# EAGLE design AntCalc (EAGLE 9.2.0)
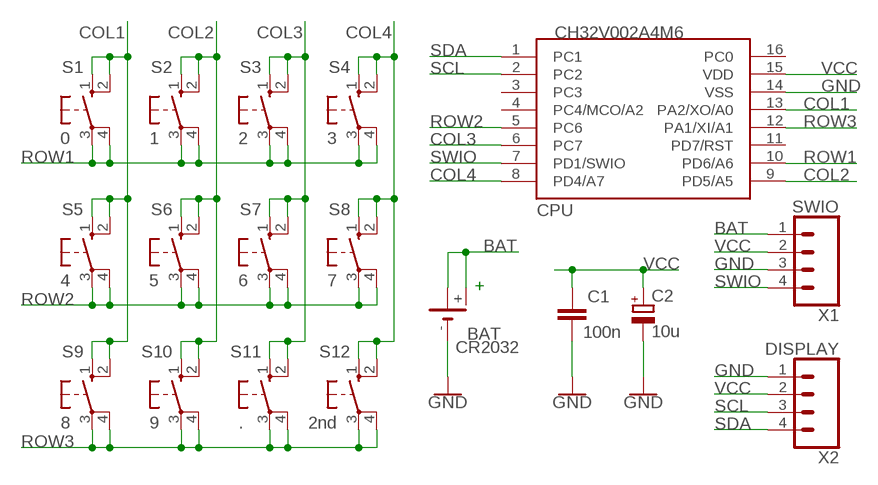
[diagram p0: schematic, sheet 1]

## Parts
BAT  CR2032  CR2032H  [CR2032H]
C1  100n  C-EUC0805K  [C0805K]
C2  10u  CPOL-EUB  [PANASONIC_B]
CPU  CH32V002A4M6  [SOP16]
S1  0  10-XXB3F-10XXC  [B3F-10XXC]
S2  1  10-XXB3F-10XXC  [B3F-10XXC]
S3  2  10-XXB3F-10XXC  [B3F-10XXC]
S4  3  10-XXB3F-10XXC  [B3F-10XXC]
S5  4  10-XXB3F-10XXC  [B3F-10XXC]
S6  5  10-XXB3F-10XXC  [B3F-10XXC]
S7  6  10-XXB3F-10XXC  [B3F-10XXC]
S8  7  10-XXB3F-10XXC  [B3F-10XXC]
S9  8  10-XXB3F-10XXC  [B3F-10XXC]
S10  9  10-XXB3F-10XXC  [B3F-10XXC]
S11  .  10-XXB3F-10XXC  [B3F-10XXC]
S12  2nd  10-XXB3F-10XXC  [B3F-10XXC]
X1  SWIO  CONN_04LONGPADS  [1X04_LONGPADS]
X2  DISPLAY  CONN_04  [1X04]

## Nets
BAT: BAT.+ BAT.+@1(+) X1.1
COL1: CPU.13(PA2/XO/A0) S1.1(S) S1.2(S1) S5.1(S) S5.2(S1) S9.1(S) S9.2(S1)
COL2: CPU.9(PD5/A5) S2.1(S) S2.2(S1) S6.1(S) S6.2(S1) S10.1(S) S10.2(S1)
COL3: CPU.6(PC7) S3.1(S) S3.2(S1) S7.1(S) S7.2(S1) S11.1(S) S11.2(S1)
COL4: CPU.8(PD4/A7) S4.1(S) S4.2(S1) S8.1(S) S8.2(S1) S12.1(S) S12.2(S1)
GND: BAT.- C1.2 C2.- CPU.14(VSS) X1.3 X2.1
ROW1: CPU.10(PD6/A6) S1.3(P) S1.4(P1) S2.3(P) S2.4(P1) S3.3(P) S3.4(P1) S4.3(P) S4.4(P1)
ROW2: CPU.5(PC6) S5.3(P) S5.4(P1) S6.3(P) S6.4(P1) S7.3(P) S7.4(P1) S8.3(P) S8.4(P1)
ROW3: CPU.12(PA1/XI/A1) S9.3(P) S9.4(P1) S10.3(P) S10.4(P1) S11.3(P) S11.4(P1) S12.3(P) S12.4(P1)
SCL: CPU.2(PC2) X2.3
SDA: CPU.1(PC1) X2.4
SWIO: CPU.7(PD1/SWIO) X1.4
VCC: C1.1 C2.+ CPU.15(VDD) X1.2 X2.2
Unconnected: CPU.3(PC3) CPU.4(PC4/MCO/A2) CPU.11(PD7/RST) CPU.16(PC0)

## Notes on the sheet
- +

## Library data of the parts
BAT = battery:CR2032H: LI BATTERY Varta
C1 = rcl:C-EU: CAPACITOR, European symbol; SPICEPREFIX: C
C2 = rcl:CPOL-EU: POLARIZED CAPACITOR, European symbol; SPICEPREFIX: C
CPU = CH32V:CH32V002A4M6
S1-S12 = switch-omron2:10-XX: OMRON SWITCH
X1 X2 = SparkFun-Connectors:CONN_04: Multi connection point. Often used as Generic Header-pin footprint for 0.1 inch spaced/style header connections On any of the 0.1 inch spaced packages, you can populate with these: Break Away Headers - Straight <https://www.sparkfun.com/products/116> (PRT-00116) Break Away Male Headers - Right Angle <https://www.sparkfun.com/products/553> (PRT-00553) Female Headers <https://www.sparkfun.com/products/115> (PRT-00115) Break Away Headers - Machine Pin <https://www.sparkfun.com/products/117> (PRT-00117) Break Away Female Headers - Swiss Machine Pin <https://www.sparkfun.com/products/743> (PRT-00743) For SCREWTERMINALS and SPRING TERMINALS visit here: Screw Terimnals on SparkFun.com <https://www.sparkfun.com/search/results?term=Screw+Terminals> (5mm/3.5mm/2.54mm spacing) This device is also useful as a general connection point to wire up your design to another part of your project. Our various solder wires solder well into these plated through hole pads. Hook-Up Wire - Assortment (Stranded, 22 AWG) <https://www.sparkfun.com/products/11375> (PRT-11375) Hook-Up Wire - Assortment (Solid Core, 22 AWG) <https://www.sparkfun.com/products/11367> (PRT-11367) View the entire wire category on our website here <https://www.sparkfun.com/categories/141> Special notes: Molex polarized connector foot print use with SKU : PRT-08231 with associated crimp pins and housings. 1MM SMD Version SKU: PRT-10208; PROD_ID: CONN-09696

## Board
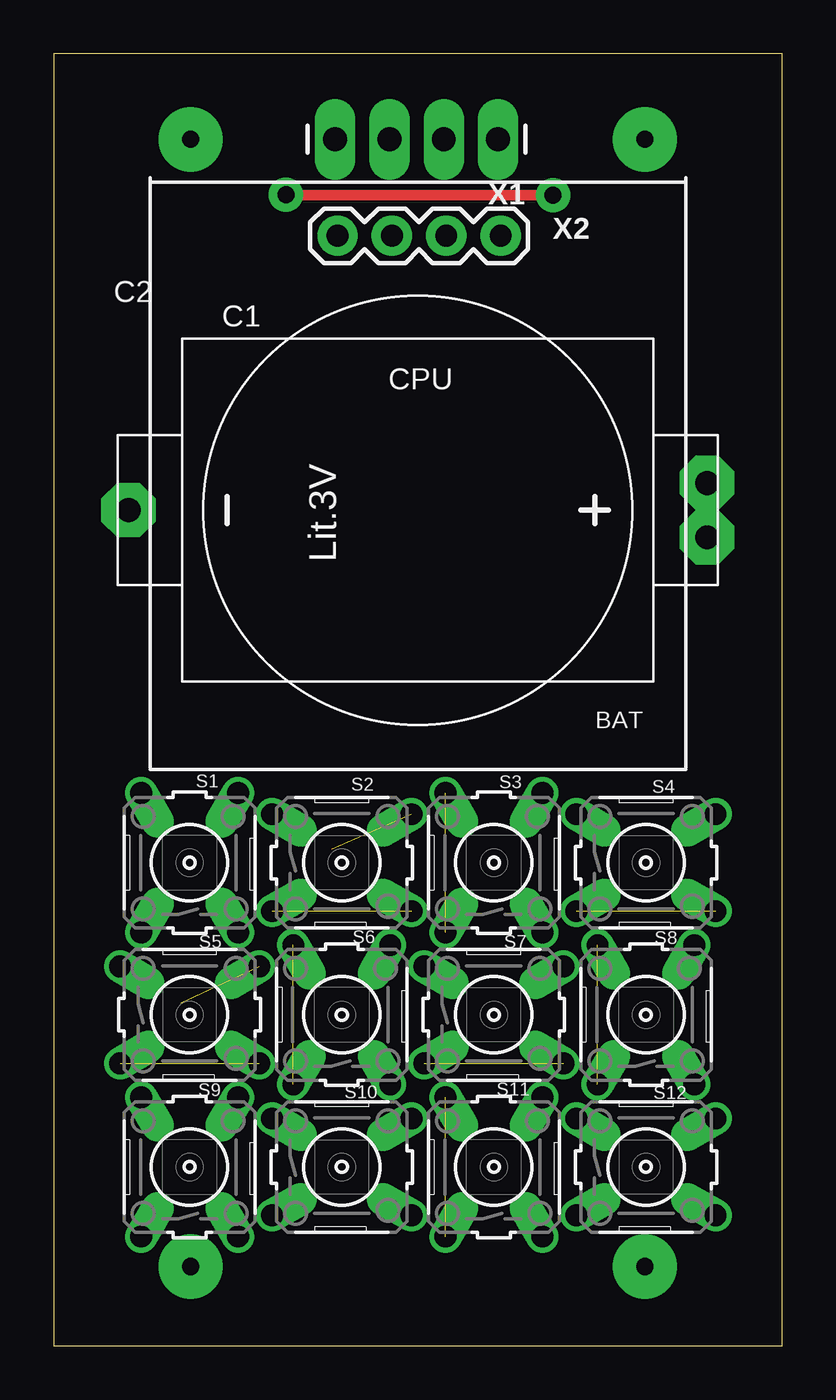
[diagram p1: board, top side]
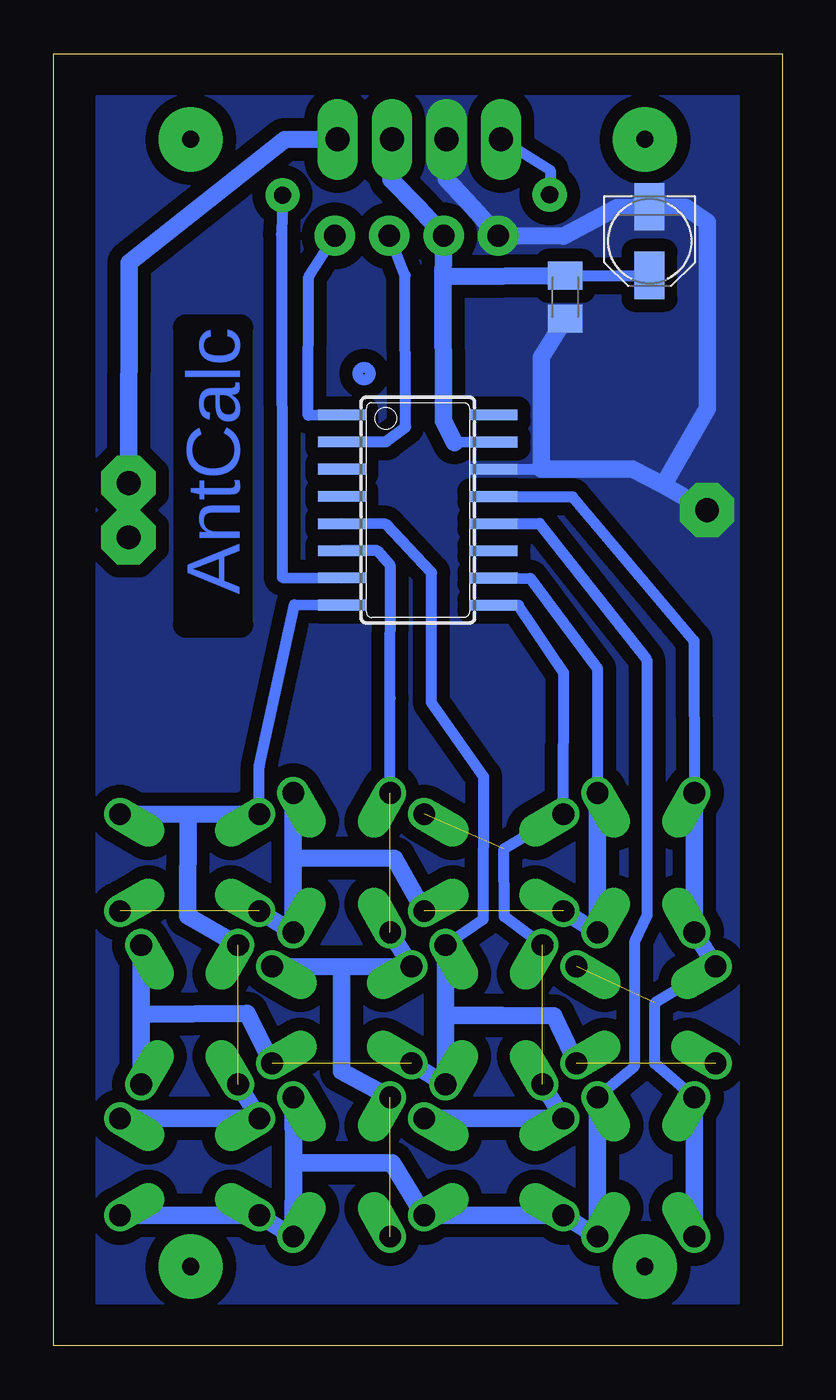
[diagram p2: board, bottom side, seen from below]

Size 34 x 60.3 mm. Coordinates in mm from the lower left corner, seen from the top.
Outline: 0,0 34,0 34,60.3 0,60.3 0,0
Copper layers (1*16): Top 0.035mm / dielectric 1.5mm / Bottom 0.035mm
Design rules "default": minimum track width 6mil, minimum drill 0.35mm, track to track 6mil, track to pad 6mil, pad to pad 6mil, via to via 6mil, smd to smd 6mil, copper to edge 40mil, drill to drill 6mil, minimum pad ring 10mil, minimum via ring 8mil, stop-mask expansion 4mil, vias tented up to drill 0mil, thermal gap 10mil

### Footprints (pad centres in the part's own frame; a part is rotated, then mirrored left to right if it is on the bottom)
CR2032H = drill 1.118 pad 2.54 octagon: + 1.27,13.5; +@1 -1.27,13.5; - 0,-13.5
C0805K = smd 1.3 x 1.6: 1 -1,0; 2 1,0
PANASONIC_B = smd 2.2 x 1.4: + 1.6,0; - -1.6,0
SOP16 = smd 0.5 x 2.2: 1 -4.445,-3.55; 2 -3.185,-3.55; 3 -1.915,-3.55; 4 -0.645,-3.55; 5 0.635,-3.55; 6 1.895,-3.55; 7 3.165,-3.55; 8 4.435,-3.55; 9 4.445,3.55; 10 3.175,3.55; 11 1.905,3.55; 12 0.635,3.55; 13 -0.635,3.55; 14 -1.905,3.55; 15 -3.175,3.55; 16 -4.445,3.55
B3F-10XXC = drill 1.016 offset: 1 -3.251,2.261; 2 3.251,2.261; 3 -3.251,-2.261; 4 3.251,-2.261
1X04_LONGPADS = drill 1.118 pad 1.88 long: 1 0,0; 2 2.54,0; 3 5.08,0; 4 7.62,0
1X04 = drill 1.016 pad 1.88: 1 0,0; 2 2.54,0; 3 5.08,0; 4 7.62,0

### Placement (x,y rotation side)
BAT  17,39 270 top
C1  10.12,48.93 270 bottom
C2  6.18,51.55 270 bottom
CPU  17,39 270 bottom
S1  6.35,22.55 90 top
S2  13.45,22.55 0 top
S3  20.55,22.55 90 top
S4  27.65,22.55 0 top
S5  6.35,15.45 0 top
S6  13.45,15.45 90 top
S7  20.55,15.45 0 top
S8  27.65,15.45 90 top
S9  6.35,8.35 90 top
S10  13.45,8.35 0 top
S11  20.55,8.35 90 top
S12  27.65,8.35 0 top
X1  20.75,56.3 180 top
X2  13.25,51.8 0 top

### Tracks (layer width: path | path; a pad name or v marks a point on that pad's centre or on a via)
BAT
  Bottom 0.813: X1.1 23.23,56.28 30.48,50.55 BAT.+@1 BAT.+
COL1  (1 unrouted)
  Bottom 0.508: S1.2 4.12,32.91 9.78,39.63 CPU.13 | S9.2 5.94,13.18 5.93,16 S5.1
  Bottom 0.813: S1.2 S1.1 S5.1 | S9.1 S9.2
COL2  (2 unrouted)
  Bottom 0.508: S6.2 12.97,20.04 12.98,23.19 S2.1 10.19,31.4 12.3,34.56 CPU.9
  Bottom 0.813: S6.1 S10.1 S10.2
COL3  (2 unrouted)
  Bottom 0.508: S3.2 18.29,30.21 18.27,36.41 18.89,37.1 CPU.6
  Bottom 0.813: S3.1 S7.1 20.56,17.7 | S11.2 20.55,12.82 20.56,17.7 | 20.56,17.7 S7.2
COL4  (1 unrouted)
  Bottom 0.508: S4.1 24.4,27.02 22.75,34.58 CPU.8 | 24.41,10.63 S12.1
  Bottom 0.813: S8.1 24.41,10.63 S12.2 | S8.2 27.74,20.07 27.73,24.8 | 27.73,24.8 S4.1 | S4.2 27.73,24.8
GND
  Bottom 0.508: CPU.14 11.23,40.92
  Bottom 0.813: X1.3 15.66,54.43 14.45,53.13 X2.1 10.2,51.78 7.71,53.12 C2.- 4.5,53.15 3.48,52.44 3.49,43.73 5.55,40.18 | 5.55,40.18 6.98,40.92 11.23,40.92 11.23,46.13 C1.2 | 5.55,40.18 BAT.-
  pour Bottom (isolate 0.61, no thermals): 2,2 2,58.3 32,58.3 32,2
N$1  (via drill 0.8 pad 3)
  other vias: 6.4,56.3
N$2  (via drill 0.8 pad 3)
  other vias: 27.6,56.3
N$3  (via drill 0.8 pad 3)
  other vias: 6.4,3.7
N$4  (via drill 0.8 pad 3)
  other vias: 27.6,3.7
ROW1  (2 unrouted)
  Bottom 0.508: S1.4 8.61,31.61 11.74,35.81 CPU.10
  Bottom 0.813: S4.3 S3.3 22.82,22.76 | 22.82,22.76 18.09,22.75 S2.4 | S2.3 S1.3 S1.4 | 22.82,22.76 S3.4
ROW2  (2 unrouted)
  Bottom 0.508: S6.4 13.95,19.91 13.92,26.55 16.36,30.03 16.36,36.08 18.48,38.34 CPU.5
  Bottom 0.813: 15.71,15.42 S6.3 S7.3 | 15.71,15.42 13.09,15.42 10.65,15.4 S5.4 | S7.4 24.96,15.52 29.91,15.46 | 29.91,15.46 S8.3 | 29.91,15.46 S8.4 | 15.71,15.42 S6.4
ROW3
  Bottom 0.508: S9.4 6.9,13.03 6.89,18.85 6.3,20.09 6.31,32.02 11.32,38.37 CPU.12
  Bottom 0.813: S12.4 S12.3 S11.3 22.8,8.53 | 22.8,8.53 18.21,8.54 S10.4 S10.3 S9.3 S9.4 | 22.8,8.53 S11.4
SCL
  Bottom 0.508: CPU.2 18.48,42.19 17.57,42.88 17.59,49.94 X2.3
SDA
  Bottom 0.508: CPU.1 22.11,43.42 22.09,49.89 X2.4
SWIO  (via drill 0.8 pad 1.6)
  Top 0.508: v10.84,53.71 v23.31,53.69
  Bottom 0.508: CPU.7 23.34,35.86 23.36,51.86 v23.31,53.69 | X1.4 10.82,54.85 10.82,53.79 v10.84,53.71
VCC
  Bottom 0.508: CPU.15 15.29,42.15 | C1.1 C2.+
  Bottom 0.813: X1.2 18.26,54.41 16.97,53.12 X2.2 15.82,49.9 | 15.29,42.15 15.8,43.14 15.82,49.9 | 15.82,49.9 C1.1
(copper drawn outside any net)
  shapes: Bottom circle x1

### Text on the board
Bottom: AntCalc
Document: OFF | ON | GND-VCC-SCL-SDA